# EAGLE schematic cam_switch_v2 LC (EAGLE 9.3.1)
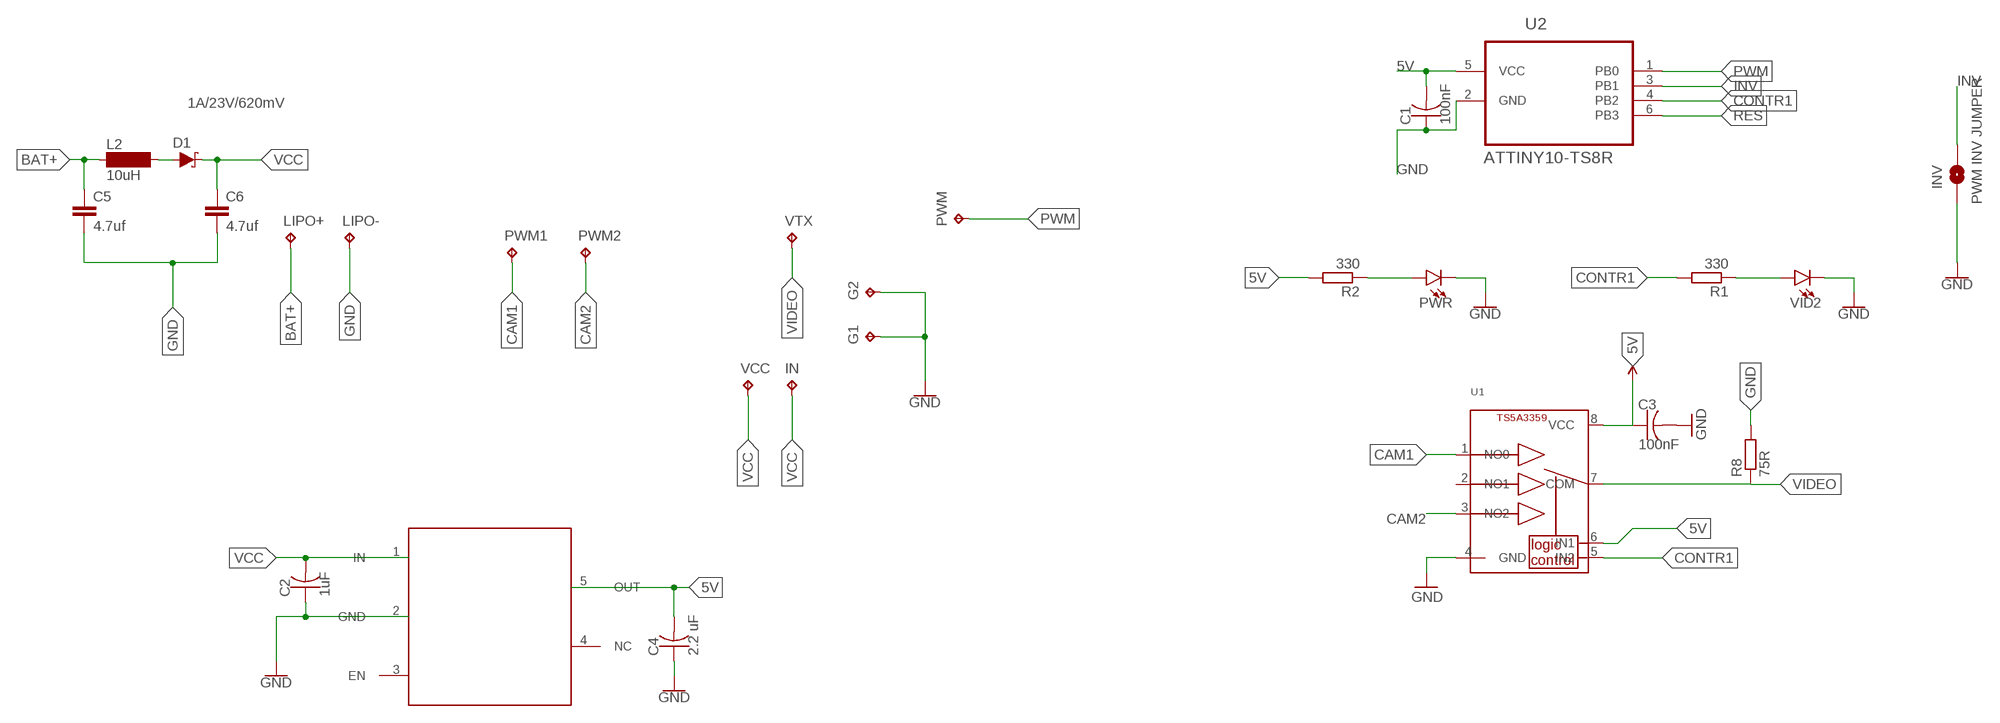
[diagram p0: schematic, sheet 1]

## Parts
C1  100nF  C-USC0603  [C0603]
C2  1uF  C-USC0805K  [C0805K]
C3  100nF  C-USC0603  [C0603]
C4  2.2 uF  C-USC0603K  [C0603K]
C5  4.7uf  C-EUC1206  [C1206]
C6  4.7uf  C-EUC1206  [C1206]
D1  1A/23V/620mV  DIODE-SCHOTTKY-BAT20J  [SOD-323]
G1  TPTP20SQ  [TP20SQ]
G2  TPTP20SQ  [TP20SQ]
IN  TPTP20SQ  [TP20SQ]
INV  PWM INV JUMPER  JUMPER-SMT_2_NO_NO-SILK  [SMT-JUMPER_2_NO_NO-SILK]
L2  10uH  MS8585  [MS85_EDITED]
LIPO+  TPTP20SQ  [TP20SQ]
LIPO-  TPTP20SQ  [TP20SQ]
PWM  TPTP20SQ  [TP20SQ]
PWM1  TPTP20SQ  [TP20SQ]
PWM2  TPTP20SQ  [TP20SQ]
PWR  LED0603  [LED-0603]
R1  330  R-EU_R0603  [R0603]
R2  330  R-EU_R0603  [R0603]
R8  75R  R-EU_R0603  [R0603]
U1  TS5A3359  [VFSOP-8]
U2  ATTINY10-TS8R  [SOT95P280X145-6N]
U$1  TPS709  [SOT95P280X145-5N]
VCC  TPTP20SQ  [TP20SQ]
VID2  LED0603  [LED-0603]
VTX  TPTP20SQ  [TP20SQ]

## Nets
5V: C1.2 C3.1 C4.2 R2.2 U1.6(IN1) U1.8(VCC) U2.5(VCC) U$1.5(OUT) ; supply symbol labelled VCC
BAT+ [vcc]: C5.1 L2.1 LIPO+.TP
CAM1: PWM1.TP U1.1(NO0)
CAM2: PWM2.TP U1.3(NO2)
CONTR1: R1.2 U1.5(IN2) U2.4(PB2)
GND: C1.1 C2.1 C3.2 C4.1 C5.2 C6.2 G1.TP G2.TP INV.1 LIPO-.TP PWR.C R8.2 U1.4(GND) U2.2(GND) U$1.2(GND) VID2.C
INV: INV.2 U2.3(PB1)
N$1: R1.1 VID2.A
N$2: PWR.A R2.1
N$3 [vcc]: D1.A L2.2
PWM: PWM.TP U2.1(PB0)
RES: U2.6(PB3)
VCC [vcc]: C2.2 C6.1 D1.C IN.TP U$1.1(IN) VCC.TP
VIDEO: R8.1 U1.7(COM) VTX.TP
Unconnected: U1.2(NO1) U$1.3(EN) U$1.4(NC)

## Library data of the parts
C1-C4 = adafruit:C-US: CAPACITOR, American symbol
C5 C6 = rcl:C-EU: CAPACITOR, European symbol; SPICEPREFIX: C
D1 = SparkFun-DiscreteSemi:DIODE-SCHOTTKY: Schottky diode A Schottky diode is a semiconductor diode which has a low forward voltage drop and a very fast switching action.; PROD_ID: DIO-11623
G1 G2 IN LIPO+ LIPO- PWM PWM1 PWM2 VCC VTX = testpad:TP: Test pad
INV = SparkFun-Jumpers:JUMPER-SMT_2_NO: Normally open jumper This jumper has two pads in close proximity to each other. Apply solder to close the connection. Round pads are easier to solder for beginners, but are a lot larger. SparkFun Product that uses the round pads: SparkFun EL Sequencer <https://www.sparkfun.com/products/12781>
L2 = inductor-neosid:MS85: INDUCTOR SMD power inductor
PWR VID2 = SparkFun-LED:LED: LED (Generic) Standard schematic elements and footprints for 5mm, 3mm, 1206, and 0603 sized LEDs. Generic LEDs with no color specified.
R1 R2 R8 = resistor:R-EU_: RESISTOR, European symbol
U1 = ts5a3359:TS5A3359: 74AUP2G126 - Low-Power Dual Tri-State Buffer OE high enables output. For OE Low enabled output use 74AUP2G125. VCC: 0.8-3.6V Temp: -40°C - 125°C Package Variant: 8-VSSOP (SOT765-1) Manuf. ID: 74AUP2G126DC,125 Digikey: 568-4987-1-ND NOTE: Make sure to check the propogation delay to see if it's short enough for your timing since it's largely dependant on the line capacitance and supply voltage!
U2 = ATTINY10-TS8R:ATTINY10-TS8R: 8-bit Microcontroller with In-System Programmable Flash; AVAILABILITY: Unavailable; DESCRIPTION: Embedded microcontroller ATTINY10-TS8R SOT 23 Microchip Technology 8-Bit 10 MHz I/O number 4; MF: Microchip; MP: ATTINY10-TS8R; PACKAGE: SOT-23-6 Microchip; PRICE: None
U$1 = SOT95P280X145-5N:TPS709

## Net classes
1 vcc: width 0.5 mm, clearance 0.381 mm